# Altium schematic sheet Power_Diagram.SchDoc
size A4; Organization: Altium Limited; Address1: L3, 12a Rodborough Rd; Address2: Frenchs Forest; Address3: NSW; Address4: Australia 2086
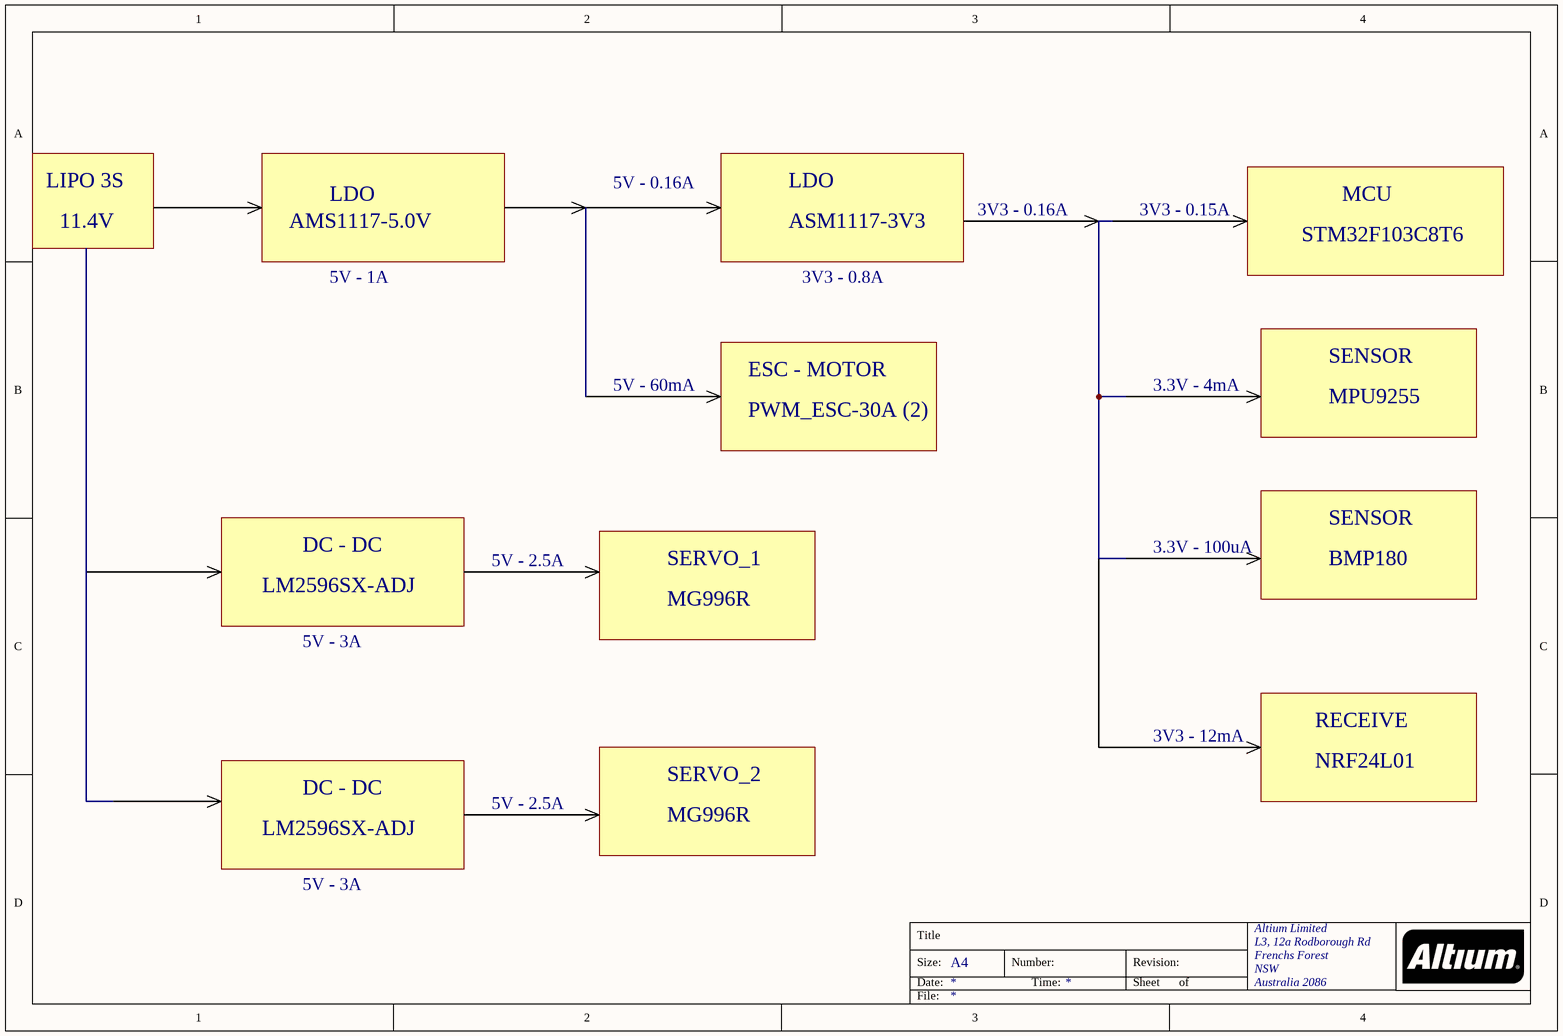
[diagram p0: Power_Diagram.SchDoc]

## Notes on the sheet
- LIPO 3S
- 11.4V
- AMS1117-5.0V
- LDO
- 5V - 0.16A
- ASM1117-3V3
- 3V3 - 0.16A
- 3V3 - 0.15A
- STM32F103C8T6
- MCU
- 5V - 1A
- 3V3 - 0.8A
- ESC - MOTOR
- SENSOR
- 5V - 60mA
- PWM_ESC-30A (2)
- 3.3V - 4mA
- MPU9255
- DC - DC
- 5V - 2.5A
- SERVO_1
- 3.3V - 100uA
- BMP180
- LM2596SX-ADJ
- 5V - 3A
- MG996R
- SERVO_2
- 3V3 - 12mA
- RECEIVE
- NRF24L01
- Title
- Size:
- Date:
- A4
- Number:
- Time:
- Revision:
- Sheet
- of
- File: